# EAGLE schematic ESP8266 1BTN (EAGLE 6.5.0)
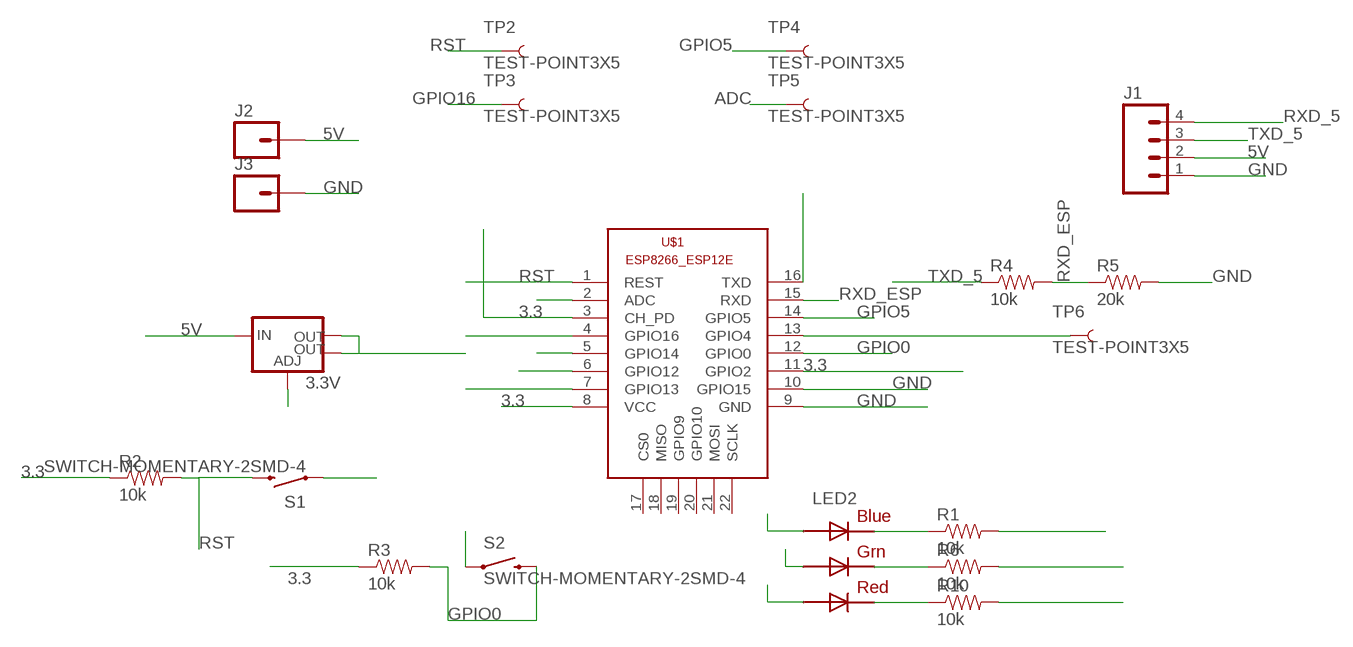
[diagram p0: schematic, sheet 1]

## Parts
3.3V  V_REG_LM1117SOT223  [SOT223]
J1  M04SMD  [1X04-SMD]
J2  M01SMD  [LUXEON-PAD]
J3  M01SMD  [LUXEON-PAD]
LED2  RGBLED5050  [RGBLED5050]
R1  10k  RESISTOR1206  [1206]
R2  10k  RESISTOR1206  [1206]
R3  10k  RESISTOR1206  [1206]
R4  10k  RESISTOR1206  [1206]
R5  20k  RESISTOR1206  [1206]
R6  10k  RESISTOR1206  [1206]
R10  10k  RESISTOR1206  [1206]
S1  SWITCH-MOMENTARY-2SMD-4  [TACTILE_SWITCH_TALL]
S2  SWITCH-MOMENTARY-2SMD-4  [TACTILE_SWITCH_TALL]
TP2  TEST-POINT3X5  [PAD.03X.05]
TP3  TEST-POINT3X5  [PAD.03X.05]
TP4  TEST-POINT3X5  [PAD.03X.05]
TP5  TEST-POINT3X5  [PAD.03X.05]
TP6  TEST-POINT3X5  [PAD.03X.05]
U$1  ESP8266-12EESP8266-ESP12E  [ESP8266-ESP12E]

## Nets
3.3: 3.3V.2(OUT) 3.3V.4(OUT) R2.1 R3.1 U$1.3(CH_PD) U$1.8(VCC) U$1.11(GPIO2)
5V: 3.3V.3(IN) J1.2 J2.P$1
ADC: TP5.P$1 U$1.2(ADC)
BLUE: LED2.3(BLUE_A) U$1.5(GPIO14)
GND: 3.3V.1(ADJ) J1.1 J3.P$1 R1.2 R5.2 R6.2 R10.2 S1.A2 S2.A2 U$1.9(GND) U$1.10(GPIO15)
GPIO0: R3.2 S2.B2 U$1.12(GPIO0)
GPIO5: TP4.P$1 U$1.14(GPIO5)
GPIO16: TP3.P$1 U$1.4(GPIO16)
GREEN: LED2.1(GREEN_A) U$1.7(GPIO13)
N$1: TP6.P$1 U$1.13(GPIO4)
N$2: LED2.6(GREEN_C) R6.1
N$5: LED2.4(BLUE_C) R1.1
N$6: LED2.5(RED_C) R10.1
RED: LED2.2(RED_A) U$1.6(GPIO12)
RST: R2.2 S1.B2 TP2.P$1 U$1.1(REST)
RXD_5: J1.4 U$1.16(TXD)
RXD_ESP: R4.2 R5.1 U$1.15(RXD)
TXD_5: J1.3 R4.1
Unconnected: U$1.17(CS0) U$1.18(MISO) U$1.19(GPIO9) U$1.20(GPIO10) U$1.21(MOSI) U$1.22(SCLK)

## Library data of the parts
3.3V = SparkFun-PowerIC:V_REG_LM1117: Voltage Regulator LM1117 Standard adjustable voltage regulator but in SMD form. Spark Fun Electronics SKU : COM-00595; PROD_ID: VREG-08170
J1 = SparkFun-Connectors:M04: Header 4 Standard 4-pin 0.1" header. Use with straight break away headers (SKU : PRT-00116), right angle break away headers (PRT-00553), swiss pins (PRT-00743), machine pins (PRT-00117), and female headers (PRT-00115). Molex polarized connector foot print use with SKU : PRT-08231 with associated crimp pins and housings. 1MM SMD Version SKU: PRT-10208
J2 J3 = SparkFun-Connectors:M01: Header 1 Standard 1-pin 0.1" header. Use with straight break away headers (SKU : PRT-00116), right angle break away headers (PRT-00553), swiss pins (PRT-00743), machine pins (PRT-00117), and female headers (PRT-00115). SMTSO-256-ET is a "flush mount" nut for a 4-40 screw. The older package used to be too tight, and did not allow it to sit properly thru the drill hit. The latest (0.165DIA) fits nice and snug.
LED2 = adafruit:RGBLED: For 5050 RGB LEDs, the order of the LEDs may vary from one manufacturer to another!
R1-R6 R10 = SparkFun-Passives:RESISTOR: Resistor Basic schematic elements and footprints for 0603, 1206, and PTH resistors.
S1 S2 = SparkFun-Electromechanical:SWITCH-MOMENTARY-2: Various NO switches- pushbuttons, reed, etc; PROD_ID: SWCH-11966
TP2-TP6 = SparkFun-Passives:TEST-POINT: Bare copper test points for troubleshooting or ICT
U$1 = esp826612e:ESP8266-12E: ESP8266-12E with additional I/O and GPIO04/05 corrected The author cannot warrant that this library is free from error or will meet your specific requirements. Created by PuceBaboon.com. Komagane, Nagano, JAPAN